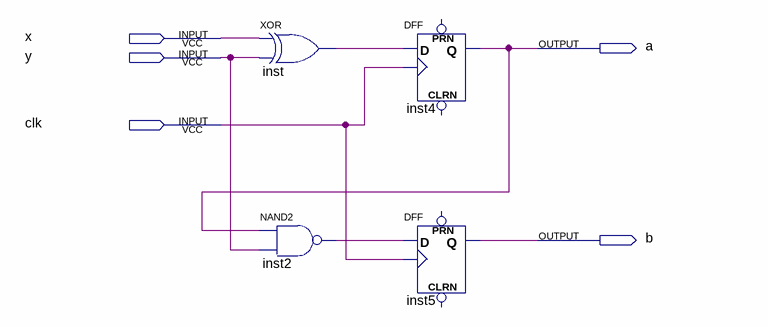
[diagram p0: schematic sheet]
// Quartus schematic wafe.bdf as structural Verilog: 4 symbols, 5 pins
module wafe (
  input  x,
  input  y,
  input  clk,
  output a,
  output b
);

  wire inst2_out, inst_out;

  xor inst (inst_out, x, y);
  nand inst2 (inst2_out, a, y);
  DFF inst4 (.CLK(clk), .D(inst_out), .Q(a));  // open: CLRN, PRN
  DFF inst5 (.CLK(clk), .D(inst2_out), .Q(b));  // open: CLRN, PRN
endmodule
